# Altium schematic sheet 12.SPI_FLASH.SchDoc: SPI FLASH
size A; SheetNumber: 12; SheetTotal: 16
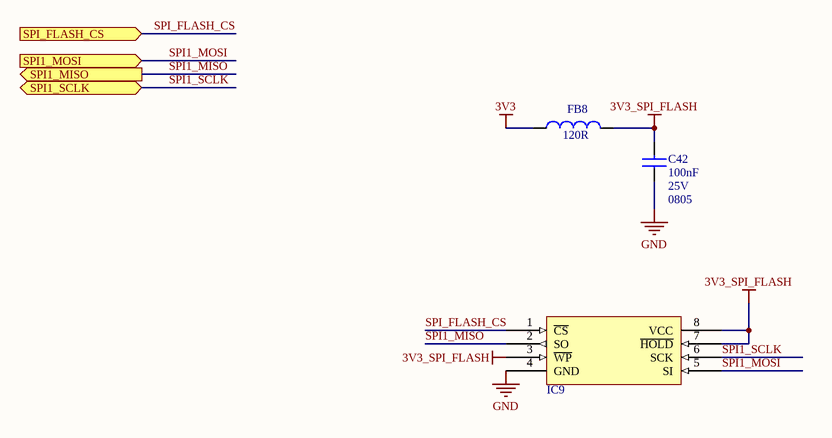
[diagram p0: 12.SPI_FLASH.SchDoc]

## Parts
C42  Capacitance: 100nF  Voltage - Rated: 25V  Package / Case: 0805  [CAPC2012X100N_EIA0805]  (hidden comment: CAP_NP)
FB8  Impedance: 120R  [FILC2012X100N_EIA0805]  (hidden comment: BEAD)
IC9  W25Q16  [SOIC127P780X216-8N]  (value not drawn)

## Ports
SPI1_MISO (out), SPI1_MOSI (in), SPI1_SCLK (bidir), SPI_FLASH_CS (in)

## Nets
3V3: FB8.1
3V3_SPI_FLASH: C42.2 FB8.2 IC9.3(~{WP}) IC9.7(~{HOLD}) IC9.8(VCC)
GND: C42.1 IC9.4(GND)
SPI1_MISO: IC9.2(SO) ; port SPI1_MISO
SPI1_MOSI: IC9.5(SI) ; port SPI1_MOSI
SPI1_SCLK: IC9.6(SCK) ; port SPI1_SCLK
SPI_FLASH_CS: IC9.1(~{CS}) ; port SPI_FLASH_CS

## Library data of the parts
C42 = SCAP00300093: CAP CER 0.1UF 25V X7R 0805; Manufacturer: Samsung Electro-Mechanics America, Inc.; Manufacturer Part Number: CL21B104KACNNNC; Value: 100nF; Tolerance: ±10%; Type: Multi Layer Ceramic Capacitor  (MLCC); Cost x1 ($): 0.10000; Cost x10 ($): 0.03300; Cost x100 ($): 0.01470; Cost x1000 ($): 0.00825; Distrubutor: Digikey; Lead Time: 11 Weeks; Part Number: SCAP00300093; Temperature Coefficient: X7R; Operating Temperature: -55°C ~ 125°C; Mounting Type: Surface Mount, MLCC; Size / Dimension: 0.079" L x 0.049" W (2.00mm x 1.25mm); Category: Capacitors; Family: Ceramic Capacitors; Distributor Part Number: 1276-1099-1-ND; Distributor Link: http://www.digikey.com/product-detail/en/samsung-electro-mechanics-america-inc/CL21B104KACNNNC/1276-1099-1-ND/3889185; ROHS: YES; Moisture Sensitivity Level (MSL): 1 (Unlimited); Quantity: 50
FB8 = SFIL00005: FERRITE CHIP POWER 120 OHM SMD; Manufacturer: Laird-Signal Integrity Products; Manufacturer Part Number: HI0805O121R-10; Type: Differential Mode - Single; Current Rating: 3.5A; DC Resistance (DCR): 20 mOhm Max; Cost x10 ($): 0.08700; Cost x100 ($): 0.05230; Cost x1000 ($): 0.03010; Distrubutor: Digikey; Cost x1 ($): 0.10000; Part Number: SFIL00005; Package / Case: 0805 (2012 Metric); Value: BEAD; Category: Filters; Family: Ferrite Beads and Chips; Distributor Part Number: 240-2393-1-ND; ROHS: YES; Datasheet Link: http://www.digikey.com/product-detail/en/HI0805O121R-10/240-2393-1-ND/806753; Quantity: 50
IC9 = SMEM00015: IC FLASH 16MBIT 104MHZ 8SOIC; Manufacturer: Winbond Electronics; Manufacturer Part Number: W25Q16DVSSIG; Value: W25Q16DVSIG; Voltage: 2.7 V ~ 3.6 V; Memory Type: FLASH - NOR; Memory Size: 16M (2M x 8); Interface: SPI Serial; Cost x10 ($): 0.43900; Cost x100 ($): 0.40533; Cost x1000 ($): 0.34068; Distrubutor: Digikey; Lead Time: 14 Weeks; Cost x1 ($): 0.45000; Part Number: SMEM00015; Package: SMD; Operating Temperature: -40°C ~ 85°C (TA); Category: Integrated Circuits (ICs); Family: Memory; Speed: 104MHz; Package / Case: 8-SOIC (0.209", 5.30mm Width); Format - Memory: FLASH; Distributor Part Number: W25Q16DVSSIG-ND; Distributor Link: http://www.digikey.com/product-detail/en/winbond-electronics/W25Q16DVSSIG/W25Q16DVSSIG-ND/4037437; ROHS: YES; MSL: 3 (168 Hours); Quantity: 5